# Altium schematic sheet Main.SchDoc: Main
size A4; Author: Ben H; Organization: Waterloop; Address1: 200 University Ave W; Address2: Engineering 5, 1104; Address3: Waterloo, ON; Address4: N2L 3G1; Revision: B; SheetNumber: 1; SheetTotal: 4
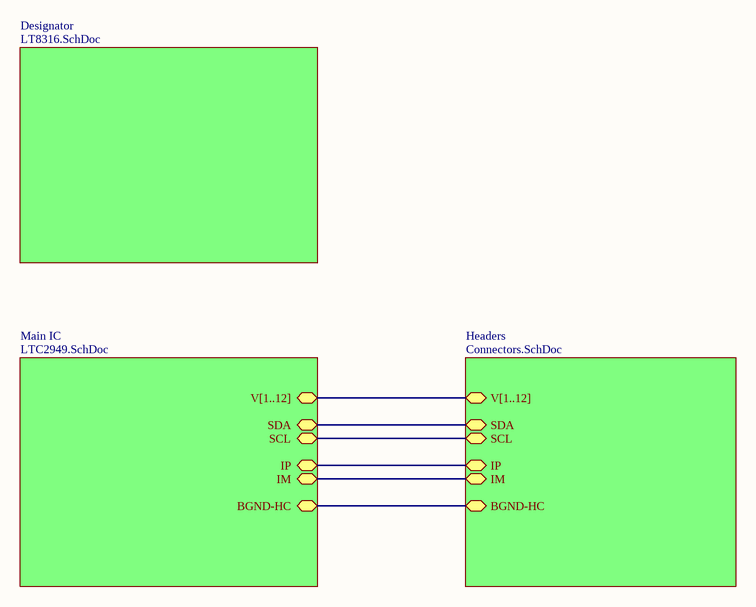
[diagram p0: Main.SchDoc]

## Sub-sheets
Designator = LT8316.SchDoc: no entries
Headers = Connectors.SchDoc: IP (bidir), IM (bidir), SDA (bidir), SCL (bidir), V[1..12] (bidir), BGND-HC (bidir)
Main IC = LTC2949.SchDoc: IP (bidir), IM (bidir), SDA (bidir), SCL (bidir), V[1..12] (bidir), BGND-HC (bidir)

## Nets
(unnamed): sheet Main IC/IP, sheet Headers/IP
(unnamed): sheet Main IC/IM, sheet Headers/IM
(unnamed): sheet Main IC/SDA, sheet Headers/SDA
(unnamed): sheet Main IC/SCL, sheet Headers/SCL
(unnamed): sheet Main IC/BGND-HC, sheet Headers/BGND-HC

## Buses and harness runs
bus sheet Headers/V[1..12] = sheet Main IC/V[1..12]

## Notes on the sheet
- Title
- Size:
- Date:
- A4
- Author:
- Time:
- Revision:
- Sheet
- of
- File: